# EAGLE design mint (EAGLE 4.16)
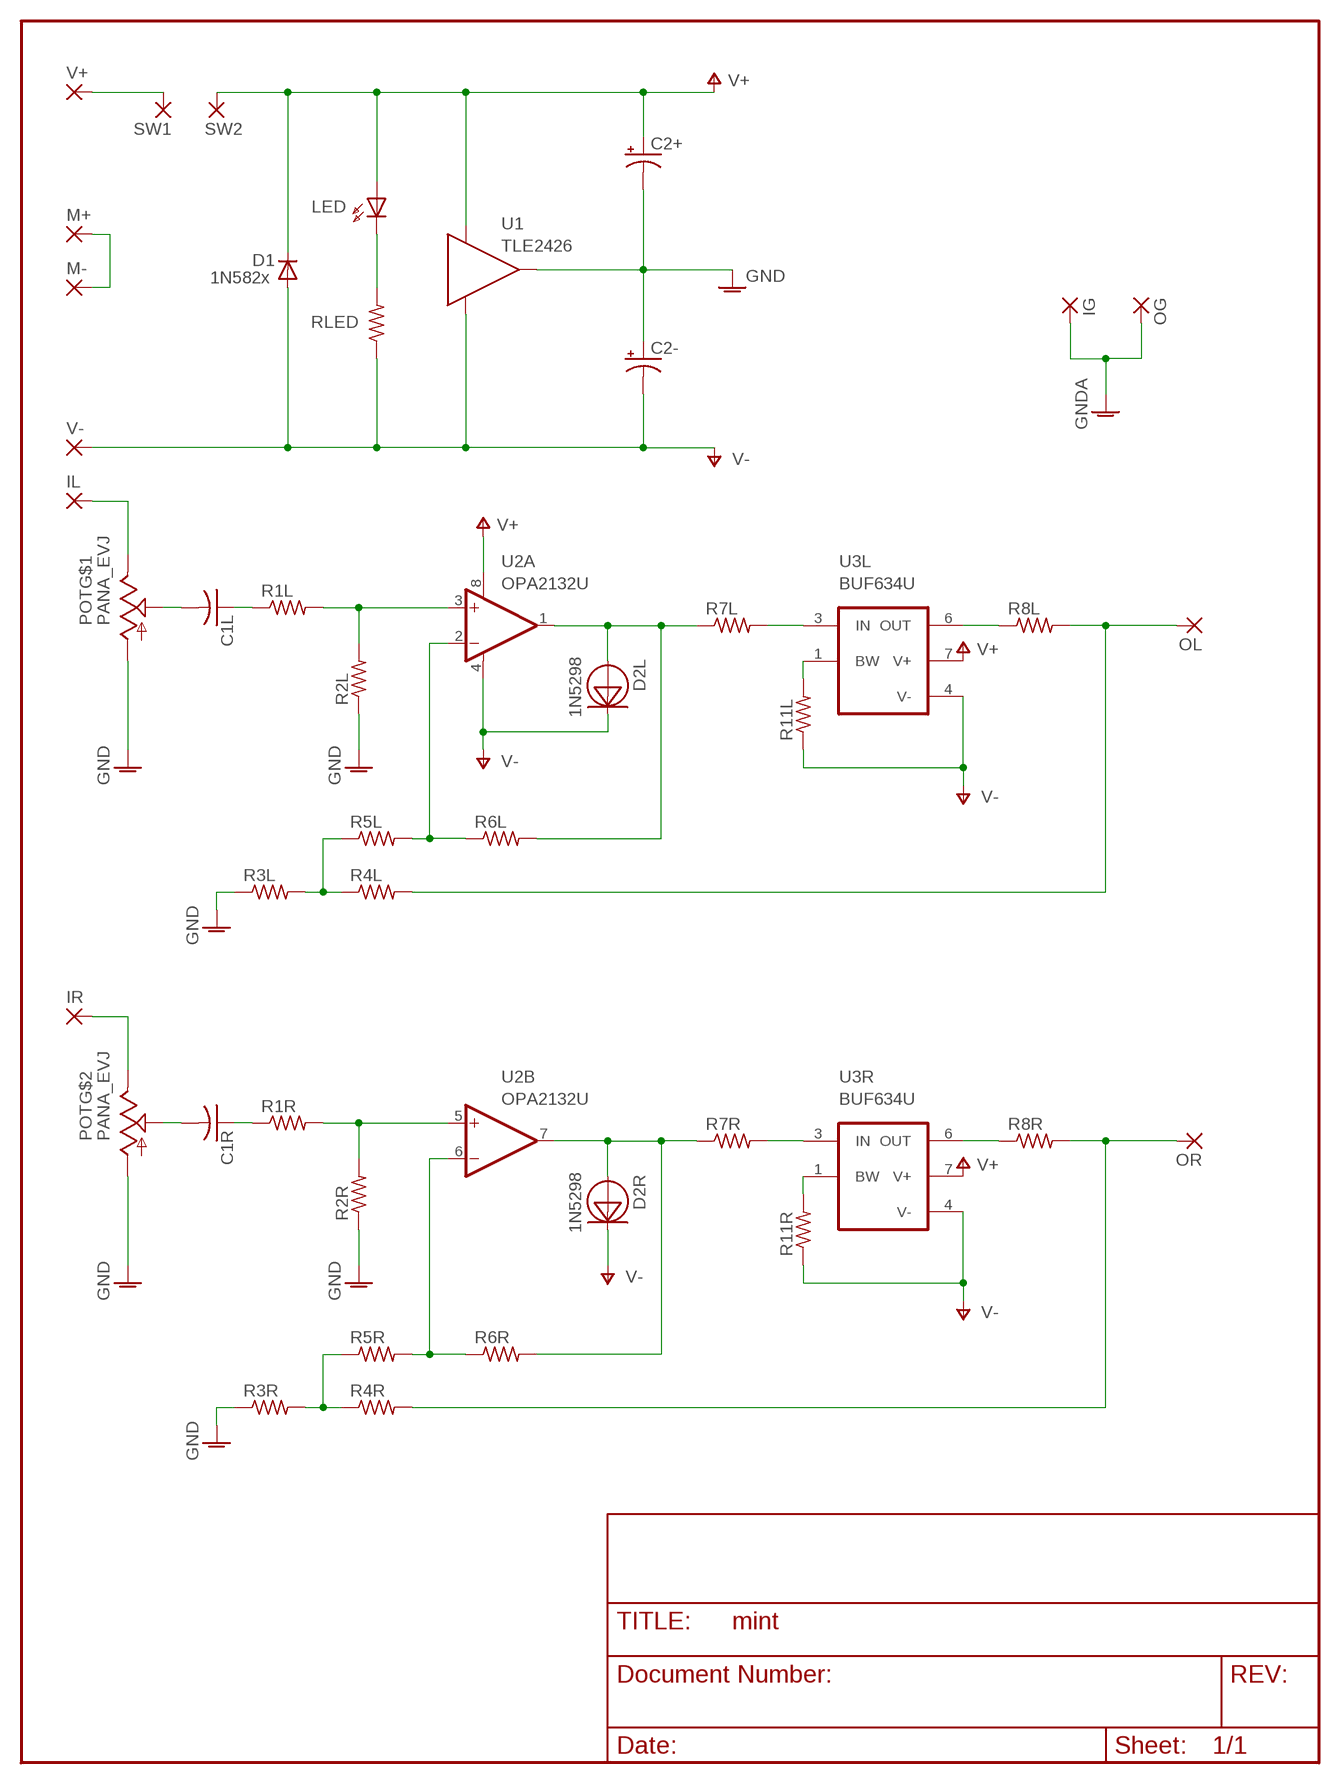
[diagram p0: schematic, sheet 1]

## Parts
C1L  C-US102-043X133  [C102-043X133]
C1R  C-US102-043X133  [C102-043X133]
C2+  CPOL-USE5-10.5  [E5-10,5]
C2-  CPOL-USE5-10.5  [E5-10,5]
D1  1N582x  1N5400  [DO201-15]
D2L  1N5298  1N5283-1N5314  [DO-35-2]
D2R  1N5298  1N5283-1N5314  [DO-35-2]
IG  2,15/1,0  [2,15/1,0]
IL  2,15/1,0  [2,15/1,0]
IR  2,15/1,0  [2,15/1,0]
LED  LED3MM  [LED3MM]
M+  2,15/1,0  [2,15/1,0]
M-  2,15/1,0  [2,15/1,0]
OG  2,15/1,0  [2,15/1,0]
OL  2,15/1,0  [2,15/1,0]
OR  2,15/1,0  [2,15/1,0]
POT  PANA_EVJ  PANA_EVJLEFT_ONLY  [PANA_EVJ_1]
R1L  R-US_0204/7  [0204/7]
R1R  R-US_0204/7  [0204/7]
R2L  R-US_0204/7  [0204/7]
R2R  R-US_0204/7  [0204/7]
R3L  R-US_0204/7  [0204/7]
R3R  R-US_0204/7  [0204/7]
R4L  R-US_0204/7  [0204/7]
R4R  R-US_0204/7  [0204/7]
R5L  R-US_0204/7  [0204/7]
R5R  R-US_0204/7  [0204/7]
R6L  R-US_0204/7  [0204/7]
R6R  R-US_0204/7  [0204/7]
R7L  R-US_0204/7  [0204/7]
R7R  R-US_0204/7  [0204/7]
R8L  R-US_0204/7  [0204/7]
R8R  R-US_0204/7  [0204/7]
R11L  R-US_0204/5  [0204/5]
R11R  R-US_0204/5  [0204/5]
RLED  R-US_0204/7  [0204/7]
SW1  2,15/1,0  [2,15/1,0]
SW2  2,15/1,0  [2,15/1,0]
U1  TLE2426  [TO226AA]
U2  OPA2132U  [SO08]
U3L  BUF634U  [SO08]
U3R  BUF634U  [SO08]
V+  2,15/1,0  [2,15/1,0]
V-  2,15/1,0  [2,15/1,0]

## Nets
GNDA: C2+.- C2-.+ IG.1(P) OG.1(P) POT.L_GND POT.R_GND R2L.1 R2R.1 R3L.1 R3R.1 U1.1(OUT) ; supply symbol labelled GND
N$1: SW1.1(P) V+.1(P)
N$2: IL.1(P) POT.L_IN
N$3: C1L.1 R1L.1
N$4: LED.K(C) RLED.2
N$5: R1L.2 R2L.2 U2.3(A:+IN)
N$6: R8L.1 U3L.6(OUT)
N$8: D2L.ANODE R6L.2 R7L.1 U2.1(A:OUT)
N$10: OL.1(P) R4L.2 R8L.2
N$11: R11L.2 U3L.1(BW)
N$12: R5L.2 R6L.1 U2.2(A:-IN)
N$13: R3L.2 R4L.1 R5L.1
N$14: R7L.2 U3L.3(IN)
N$15: C1L.2 POT.L_OUT
N$17: IR.1(P) POT.R_IN
N$18: C1R.1 R1R.1
N$19: R1R.2 R2R.2 U2.5(B:+IN)
N$20: M+.1(P) M-.1(P)
N$21: D2R.ANODE R6R.2 R7R.1 U2.7(B:OUT)
N$22: R8R.1 U3R.6(OUT)
N$23: R11R.2 U3R.1(BW)
N$24: OR.1(P) R4R.2 R8R.2
N$25: R5R.2 R6R.1 U2.6(B:-IN)
N$26: R3R.2 R4R.1 R5R.1
N$27: R7R.2 U3R.3(IN)
N$28: C1R.2 POT.R_OUT
V+: C2+.+ D1.C LED.A SW2.1(P) U1.3(IN) U2.8(A:V+) U3L.7(V+) U3R.7(V+)
V-: C2-.- D1.A D2L.CATHODE D2R.CATHODE R11L.1 R11R.1 RLED.1 U1.2(COM) U2.4(A:V-) U3L.4(V-) U3R.4(V-) V-.1(P)

## Library data of the parts
C1L C1R = rcl:C-US: CAPACITOR, American symbol
C2+ C2- = rcl:CPOL-US: POLARIZED CAPACITOR, American symbol
D1 = diode:1N5400: DIODE standard rectifier, 3 A, 50 V (Motorola)
D2L D2R = crd:1N5283-1N5314: 1N5283-1N5314 series current-regulating diodes
IG IL IR M+ M- OG OL OR SW1 SW2 V+ V- = wirepad:2,15/1,0: THROUGH-HOLE PAD
LED = led:LED: LED
POT = audio-pots:PANA_EVJ: Panasonic EVJ series potentiometer
R1L R1R R2L R2R R3L R3R R4L R4R R5L R5R R6L R6R R7L R7R R8L R8R R11L R11R RLED = rcl:R-US_: RESISTOR, American symbol
U1 = tle2426:TLE2426
U2 = burr-brown:OPA2132: High Speed FET-Input Operational Amplifiers< Product Folder:OPA2132
U3L U3R = burr-brown:BUF634: 250mA High-Speed Buffer

## Board
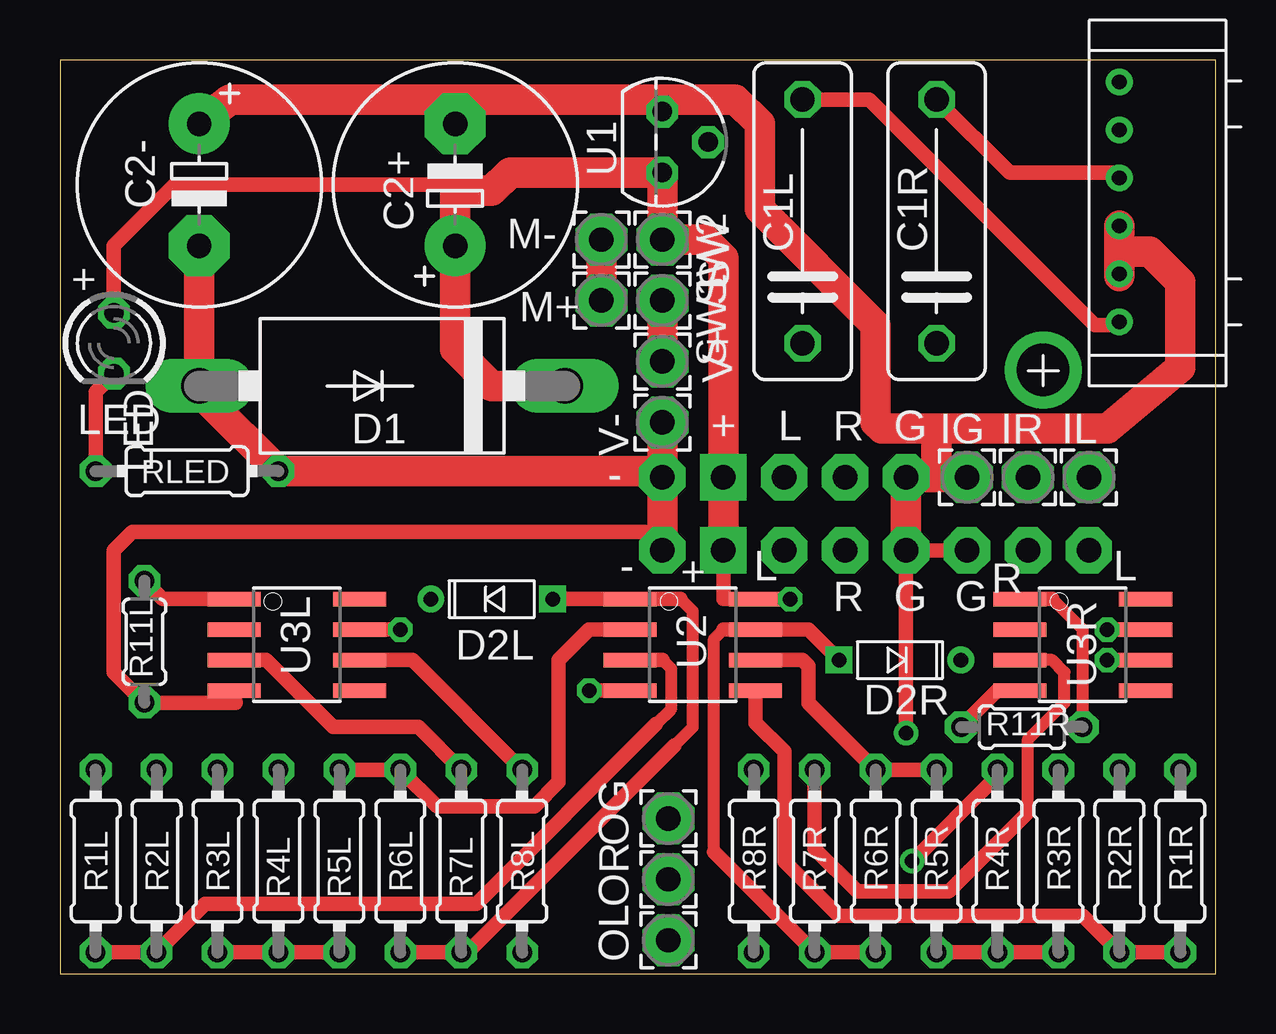
[diagram p1: board, top side]
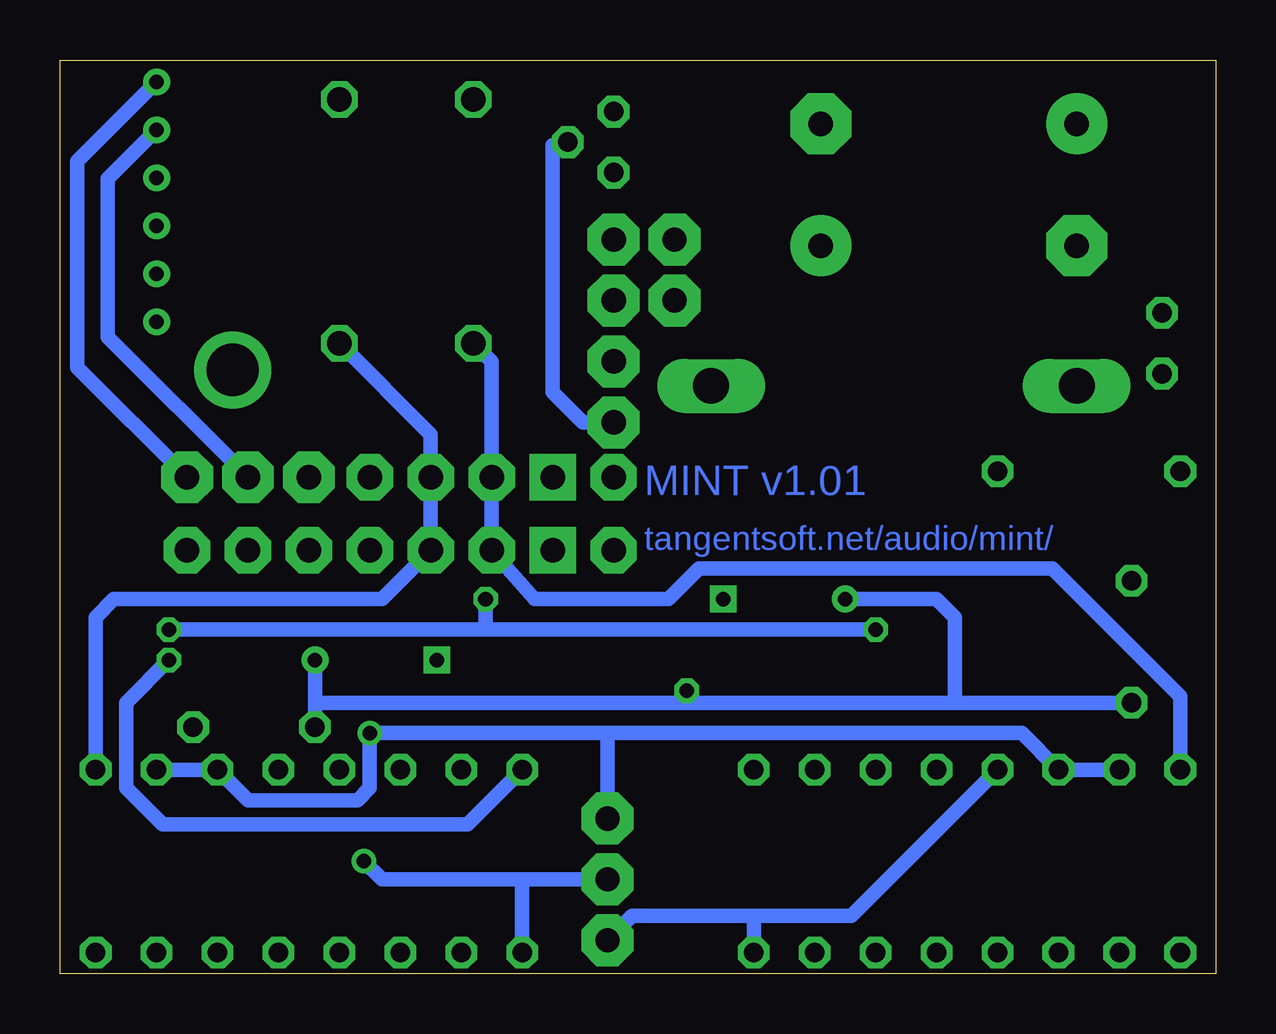
[diagram p2: board, bottom side, seen from below]

Size 48.18 x 38.09 mm. Coordinates in mm from the lower left corner, seen from the top.
Outline: 0,0 48.18,0 48.18,38.09 0,38.09 0,0
Copper layers (1*16): Top 0.035mm / dielectric 1.5mm / Bottom 0.035mm
Design rules "default": minimum track width 10mil, minimum drill 24mil, track to track 8mil, track to pad 8mil, pad to pad 8mil, via to via 8mil, smd to smd 8mil, copper to edge 40mil, drill to drill 8mil, minimum pad ring 10mil, minimum via ring 8mil, stop-mask expansion 4mil, vias tented up to drill 0mil, thermal gap 10mil

### Footprints (pad centres in the part's own frame; a part is rotated, then mirrored left to right if it is on the bottom)
C102-043X133 = drill 1.016 octagon: 1 -5.08,0; 2 5.08,0
E5-10,5 = drill 1.016 pad 2.54 round: + -2.54,0 | drill 1.016 pad 2.54 octagon: - 2.54,0
DO201-15 = drill 1.499 long: A 7.62,0; C -7.62,0
DO-35-2 = drill 0.61 square: ANODE -2.54,0 | drill 0.61 round: CATHODE 2.54,0
2,15/1,0 = drill 1.016 pad 2.159 octagon: 1 0,0
LED3MM = drill 0.813 octagon: A -1.27,0; K 1.27,0
PANA_EVJ_1 = drill 0.61 round: L_GND 1.27,2.95; L_IN 1.27,-5.05; L_OUT 1.27,4.95; R_GND 1.27,0.95; R_IN 1.27,-3.05; R_OUT 1.27,-1.05 | drill 2.184 round: P$7 4.443,6.958
0204/7 = drill 0.813 octagon: 1 -3.81,0; 2 3.81,0
0204/5 = drill 0.813 octagon: 1 -2.54,0; 2 2.54,0
TO226AA = drill 0.813 octagon: 1 -1.27,0; 2 0,1.905; 3 1.27,0
SO08 = smd 0.61 x 2.21: 1 -1.905,-2.616; 2 -0.635,-2.616; 3 0.635,-2.616; 4 1.905,-2.616; 5 1.905,2.616; 6 0.635,2.616; 7 -0.635,2.616; 8 -1.905,2.616

### Placement (x,y rotation side)
C1L  30.95,31.36 90 top
C1R  36.54,31.36 90 top
C2+  16.47,32.89 90 top
C2-  5.8,32.89 270 top
D1  13.42,24.51 180 top
D2L  18,15.62 180 top
D2R  35.01,13.08 0 top
IG  37.81,20.7 0 top
IL  42.89,20.7 0 top
IR  40.35,20.7 0 top
LED  2.25,26.28 270 top
M+  22.57,28.06 0 top
M-  22.57,30.6 0 top
OG  25.36,6.47 90 top
OL  25.36,1.39 90 top
OR  25.36,3.93 90 top
POT  45.43,32.13 180 top
R1L  1.49,4.69 270 top
R1R  46.7,4.69 270 top
R2L  4.03,4.69 270 top
R2R  44.16,4.69 270 top
R3L  6.57,4.69 270 top
R3R  41.62,4.69 270 top
R4L  9.11,4.69 90 top
R4R  39.08,4.69 90 top
R5L  11.65,4.69 90 top
R5R  36.54,4.69 90 top
R6L  14.19,4.69 270 top
R6R  34,4.69 270 top
R7L  16.73,4.69 90 top
R7R  31.46,4.69 90 top
R8L  19.27,4.69 270 top
R8R  28.92,4.69 270 top
R11L  3.52,13.84 90 top
R11R  40.09,10.28 0 top
RLED  5.3,20.95 180 top
SW1  25.11,28.06 270 top
SW2  25.11,30.6 270 top
U1  25.11,34.67 270 top
U2  26.38,13.71 270 top
U3L  9.87,13.71 270 top
U3R  42.63,13.71 270 top
V+  25.11,25.52 90 top
V-  25.11,22.98 90 top

### Tracks (layer width: path | path; a pad name or v marks a point on that pad's centre or on a via)
GNDA  (via drill 0.61)
  Top 0.61: v35.27,10.03 35.27,17.65 37.81,17.65
  Top 1.27: 16.47,36.44 25.11,36.44 | C2-.+ 7.07,36.44 16.47,36.44 | 16.47,36.44 C2+.- | 25.11,36.44 U1.1 | 25.11,36.44 28.16,36.44 29.17,35.43 29.17,31.87 34,27.05 34,22.98 34.25,22.73 36.54,22.73 | 36.54,22.73 43.65,22.73 46.7,25.27 46.7,28.82 45.43,30.09 44.16,30.09 POT.L_GND | POT.L_GND 44.16,29.08 | POT.L_GND POT.R_GND | 36.54,20.7 IG.1 | 36.54,22.73 36.54,20.7 | 36.54,20.7 35.27,20.7 35.27,17.65
  Bottom 0.61: R2L.1 R3L.1 8.09,10.03 25.36,10.03 | R2R.1 R3R.1 40.35,7.23 35.78,7.23 35.27,7.74 v35.27,10.03 25.36,10.03 | 25.36,10.03 OG.1
N$1
  Top 1.27: SW1.1 V+.1
N$2
  Bottom 0.61: POT.L_IN 47.46,33.87 47.46,25.27 IL.1
N$3
  Bottom 0.61: C1L.1 30.19,25.52 30.19,17.65 28.41,15.62 22.82,15.62 21.55,16.89 6.82,16.89 1.49,11.55 R1L.1
N$4
  Top 0.61: LED.K 1.49,24.25 RLED.2
N$5
  Top 0.508: 24.85,10.41 25.49,11.04 25.49,12.7 25.11,13.08
  Top 0.61: R1L.2 R2L.2 6.06,2.92 17.36,2.92 24.85,10.41 | 25.11,13.08 U2.3
N$6
  Top 0.61: R8L.1 14.69,13.08 U3L.6
N$7  (via drill 1.02 pad 1.93)
  other vias: 42.89,17.65
N$8
  Top 0.508: 25.87,15.62 26.38,15.11 26.38,10.28 25.62,9.52
  Top 0.61: 23.84,15.62 U2.1 D2L.ANODE 25.87,15.62 | 25.62,9.52 16.98,0.88 R7L.1 R6L.2 13.93,0.88
N$9  (via drill 1.02 pad 1.93)
  other vias: 25.11,20.7
N$10
  Bottom 0.61: R4L.2 15.2,2.41 19.27,2.41 | 19.27,2.41 R8L.2 | 19.27,2.41 24.35,2.41 OL.1
N$11
  Top 0.61: R11L.2 4.28,15.62 U3L.1
N$12
  Top 0.61: R5L.2 R6L.1 15.71,6.98 19.77,6.98 20.79,8 20.79,13.08 22.06,14.35 U2.2
N$13
  Top 0.61: R5L.1 R4L.1 R3L.2
N$14
  Top 0.61: R7L.2 14.95,10.28 11.39,10.28 8.6,13.08 U3L.3
N$15
  Top 0.61: C1L.2 33.74,36.44 43.14,27.05 44.16,27.05 POT.L_OUT
N$16  (via drill 1.02 pad 1.93)
  other vias: 40.35,17.65
N$17
  Bottom 0.61: POT.R_IN 46.19,33.14 46.19,26.54 IR.1
N$18
  Bottom 0.61: C1R.1 32.73,22.47 32.73,17.65 34.76,15.62 45.94,15.62 46.7,14.85 R1R.1 46.95,8.5
N$19
  Top 0.61: U2.5 28.99,10.46 30.19,9.27 30.19,4.69 32.47,2.41 42.63,2.41 R2R.2 R1R.2
N$20
  Top 1.27: M-.1 M+.1
N$21
  Top 0.508: 27.27,5.08 27.27,13.96 27.65,14.35
  Top 0.61: U2.7 31.2,14.35 | R6R.2 R7R.1 27.27,5.08 | 27.65,14.35 31.2,14.35 | 31.2,14.35 D2R.ANODE
N$22  (via drill 0.61)
  Top 0.61: 45.17,13.08 U3R.6 v43.65,13.08
  Bottom 0.61: R8R.1 31.2,6.22 43.9,6.22 45.43,7.74 45.43,11.3 v43.65,13.08
N$23
  Top 0.508: R11R.2 42.63,14.35 41.36,15.62
  Top 0.61: 41.36,15.62 U3R.1
N$24  (via drill 0.61)
  Top 0.61: v35.52,4.69 39.08,8.25 R4R.2
  Bottom 0.61: OR.1 28.92,3.93 | 28.92,3.93 R8R.2 | 28.92,3.93 34.76,3.93 v35.52,4.69
N$25
  Top 0.61: R5R.2 R6R.1 31.2,11.3 31.2,12.82 30.95,13.08 U2.6
N$26
  Top 0.61: R5R.1 R4R.1 R3R.2
N$27
  Top 0.508: U3R.3 41.36,13.08 41.87,12.57 41.87,11.3 40.35,9.77 40.35,6.73
  Top 0.61: 40.35,6.73 37.05,3.42 33.24,3.42 31.46,5.2 R7R.2
N$28
  Top 0.61: C1R.2 39.59,33.4 44.16,33.4 POT.R_OUT
N$29  (via drill 1.02 pad 1.93)
  other vias: 37.81,17.65
N$30  (via drill 1.02 pad 1.93)
  other vias: 35.27,17.65
N$31  (via drill 1.02 pad 1.93)
  other vias: 32.73,17.65
N$32  (via drill 1.02 pad 1.93)
  other vias: 30.19,17.65
N$33  (via drill 1.02 pad 1.93)
  other vias: 27.65,17.65
N$35  (via drill 1.02 pad 1.93)
  other vias: 35.27,20.7
N$36  (via drill 1.02 pad 1.93)
  other vias: 32.73,20.7
N$37  (via drill 1.02 pad 1.93)
  other vias: 30.19,20.7
N$38  (via drill 1.02 pad 1.93)
  other vias: 27.65,20.7
N$39  (via drill 1.02 pad 1.93)
  other vias: 25.11,17.65
V+  (via drill 0.61)
  Top 0.61: 27.65,17.65 27.65,15.62 v30.44,15.62 U2.8 | U3L.7 v14.19,14.35 | v43.65,14.35 U3R.7 | LED.A 2.25,30.35 4.79,32.89 16.47,32.89 16.47,32.63
  Top 1.27: 27.65,17.65 27.65,29.84 26.89,30.6 SW2.1 U1.3 18.76,33.4 18,32.63 16.47,32.63 C2+.+ 16.47,26.03 18,24.51 D1.C
  Bottom 0.61: v14.19,14.35 30.44,14.35 | 30.44,14.35 v30.44,15.62 | 30.44,14.35 v43.65,14.35
V-  (via drill 0.61)
  Top 0.61: 40.09,11.81 U3R.4 39.08,11.81 R11R.1 | 25.11,18.41 3.01,18.41 2.25,17.65 2.25,12.57 R11L.1 7.33,11.3 7.25,11.73 U3L.4 | v22.06,11.81 U2.4 v22.06,11.81
  Top 1.27: D1.A C2-.- D1.A | D1.A 6.06,24 RLED.1 25.11,20.95 | 25.11,20.95 25.11,18.41 25.11,17.65 | 25.11,20.95 V-.1
  Bottom 0.61: R11L.1 10.88,11.3 | 22.06,11.3 37.55,11.3 | D2R.CATHODE 37.55,11.3 | 37.55,11.3 R11R.1 | D2L.CATHODE 11.65,15.62 10.88,14.85 10.88,11.3 | 10.88,11.3 22.06,11.3 | 22.06,11.3 v22.06,11.81 | U1.2 27.65,34.54 27.65,24.25 26.38,22.98 V-.1

### Text on the board
Bottom: MINT v1.01 | tangentsoft.net/audio/mint/
tPlace: + | SW | LED | + | L | R | G | - | - | + | L | R | L | R | G | G